# EAGLE design blinkm_mk2j1 (EAGLE 6.5.0)
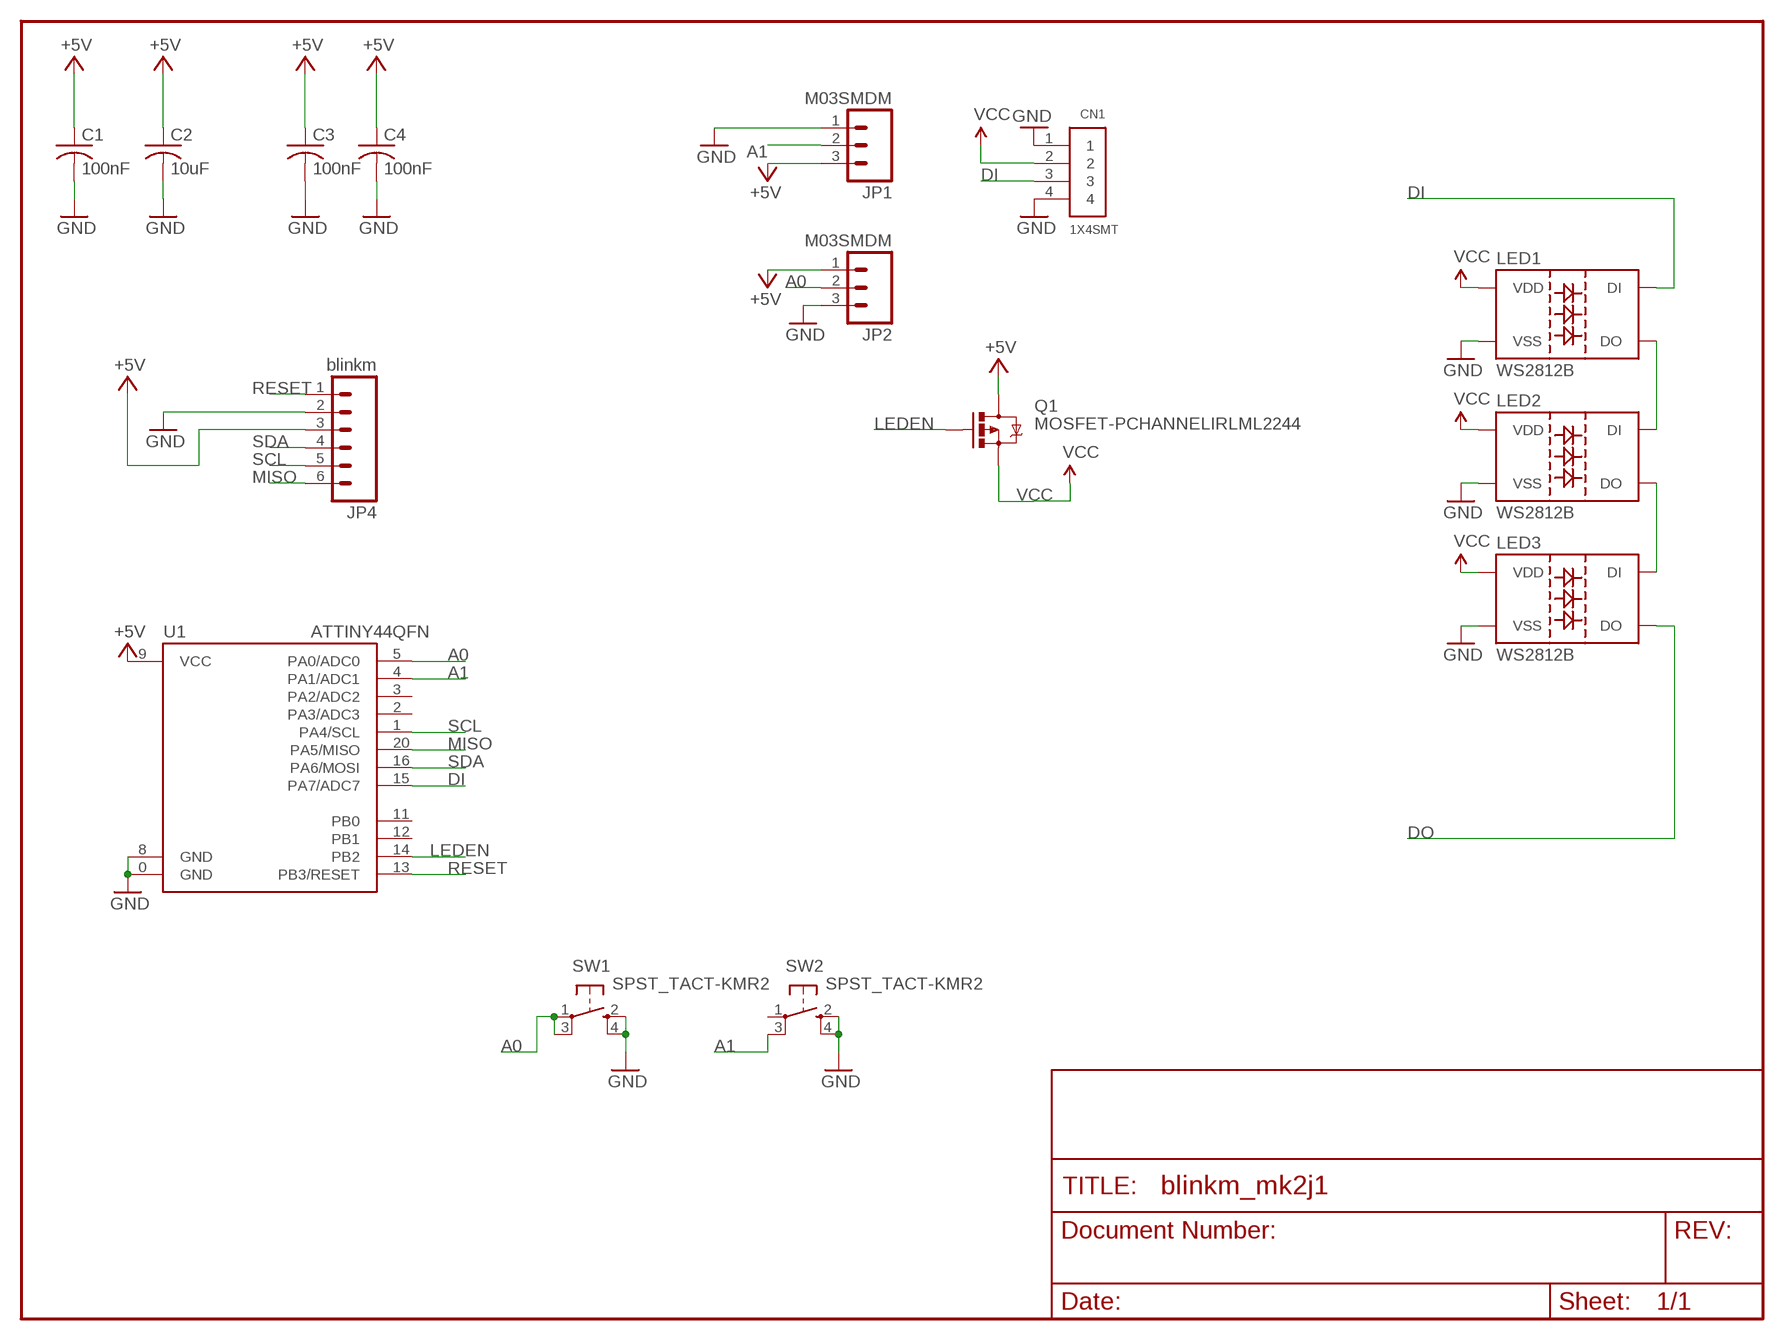
[diagram p0: schematic, sheet 1]

## Parts
C1  100nF  C-USC0603  [C0603]
C2  10uF  C-USC0603  [C0603]
C3  100nF  C-USC0603  [C0603]
C4  100nF  C-USC0603  [C0603]
CN1  1X4SMT  [1X4-SMT]
JP1  M03SMDM  [1X03-SMD-MINIMAL]
JP2  M03SMDM  [1X03-SMD-MINIMAL]
JP4  blinkm  M06LOCK  [1X06_LOCK]
LED1  WS2812B  [WS2812B]
LED2  WS2812B  [WS2812B]
LED3  WS2812B  [WS2812B]
Q1  MOSFET-PCHANNELIRLML2244  [SOT23-3]
SW1  SPST_TACT-KMR2  [KMR2]
SW2  SPST_TACT-KMR2  [KMR2]
U1  ATTINY44QFN  ATTINY24QFN  [QFN20]

## Nets
+5V: C1.1 C2.1 C3.1 C4.1 JP1.3 JP2.1 JP4.3 Q1.3(D) U1.9(VCC)
A0: JP2.2 SW1.1(P) SW1.3(P1) U1.5(PA0/ADC0)
A1: JP1.2 SW2.3(P1) U1.4(PA1/ADC1)
DI: CN1.3 LED1.4(DI) U1.15(PA7/ADC7)
DO: LED3.2(DO)
DOI1: LED1.2(DO) LED2.4(DI)
DOI2: LED2.2(DO) LED3.4(DI)
GND: C1.2 C2.2 C3.2 C4.2 CN1.1 CN1.4 JP1.1 JP2.3 JP4.2 LED1.3(VSS) LED2.3(VSS) LED3.3(VSS) SW1.2(S) SW1.4(S1) SW2.2(S) SW2.4(S1) U1.0(GND) U1.8(GND)
LEDEN: Q1.1(G) U1.14(PB2)
MISO: JP4.6 U1.20(PA5/MISO)
RESET: JP4.1 U1.13(PB3/RESET)
SCL: JP4.5 U1.1(PA4/SCL)
SDA: JP4.4 U1.16(PA6/MOSI)
VCC: CN1.2 LED1.1(VDD) LED2.1(VDD) LED3.1(VDD) Q1.2(S)
Unconnected: SW2.1(P) U1.2(PA3/ADC3) U1.3(PA2/ADC2) U1.11(PB0) U1.12(PB1)

## Library data of the parts
C1-C4 = rcl:C-US: CAPACITOR, American symbol
CN1 = adafruit:1X4: 4-pin connector
JP1 JP2 = todstuff:M03
JP4 = SparkFun-Connectors:M06: Header 6 Standard 6-pin 0.1" header. Use with straight break away headers (SKU : PRT-00116), right angle break away headers (PRT-00553), swiss pins (PRT-00743), machine pins (PRT-00117), and female headers (PRT-00115). Molex polarized connector foot print use with SKU : PRT-08094 with associated crimp pins and housings. NOTES ON THE VARIANTS LOCK and LOCK_LONGPADS... This footprint was designed to help hold the alignment of a through-hole component (i.e. 6-pin header) while soldering it into place. You may notice that each hole has been shifted either up or down by 0.005 of an inch from it's more standard position (which is a perfectly straight line). This slight alteration caused the pins (the squares in the middle) to touch the edges of the holes. Because they are alternating, it causes a "brace" to hold the component in place. 0.005 has proven to be the perfect amount of "off-center" position when using our standard breakaway headers. Although looks a little odd when you look at the bare footprint, once you have a header in there, the alteration is very hard to notice. Also, if you push a header all the way into place, it is covered up entirely on the bottom side. This idea of altering the position of holes to aid alignment will be further integrated into the Sparkfun Library for other footprints. It can help hold any component with 3 or more connection pins.
LED1-LED3 = WS2812:WS2812B
Q1 = SparkFun-DiscreteSemi:MOSFET-PCHANNEL: Generic PMOSFET; PROD_ID: TRANS-11153
SW1 SW2 = adafruit:SPST_TACT: SMT 6mm switch, EVQQ2 series http://www.ladyada.net/library/eagle
U1 = SparkFun-DigitalIC:ATTINY24: Atmel 20-pin 2kB flash uC

## Board
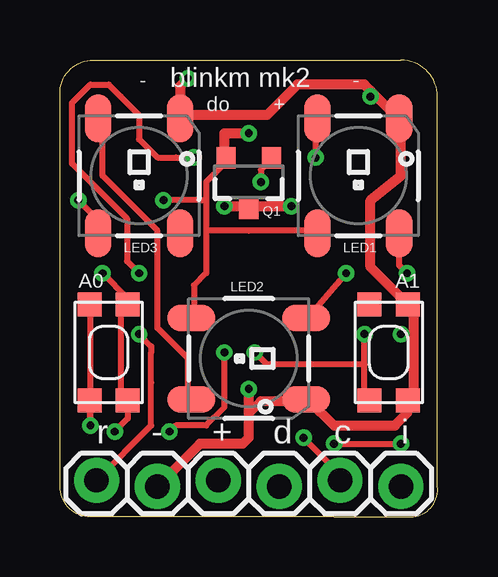
[diagram p1: board, top side]
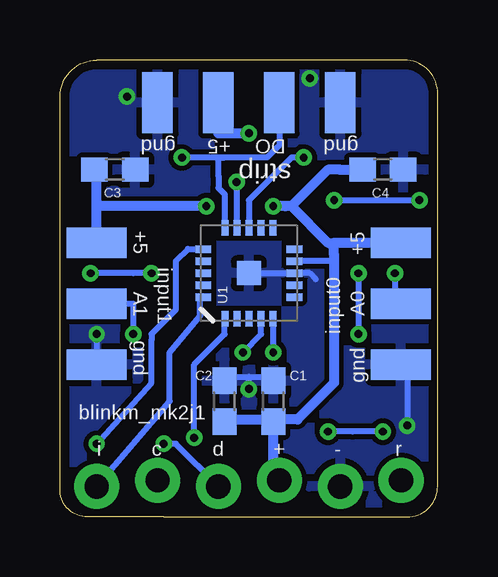
[diagram p2: board, bottom side, seen from below]

Size 15.75 x 19.06 mm. Coordinates in mm from the lower left corner, seen from the top.
Outline: 11.43,0 1.27,0 arc-90 0,1.27 0,17.78 arc-90 1.52,19.05 14.22,19.05 arc-90 15.75,17.53 15.75,1.27 arc-90 14.73,0 11.43,0
Copper layers (1*16): Top 0.0356mm / dielectric 1.5011mm / Bottom 0.0356mm
Design rules "LaenPCBOrder-tod *": minimum track width 10mil, minimum drill 13mil, track to track 8mil, track to pad 8mil, pad to pad 8mil, via to via 8mil, smd to smd 6mil, copper to edge 15mil, drill to drill 8mil, minimum pad ring 7mil, minimum via ring 7mil, stop-mask expansion 4mil, vias tented up to drill 25mil, thermal gap 10mil

### Footprints (pad centres in the part's own frame; a part is rotated, then mirrored left to right if it is on the bottom)
C0603 = smd 1.1 x 1: 1 -0.85,0; 2 0.85,0
1X4-SMT = smd 1.27 x 2.54: 1 -3.81,0; 2 -1.27,0; 3 1.27,0; 4 3.81,0
1X03-SMD-MINIMAL = smd 1.27 x 2.5: 1 -2.54,-0.01; 2 0,-0.01; 3 2.54,-0.01
1X06_LOCK = drill 1.016 pad 1.88: 1 0,0; 2 2.54,-0.254; 3 5.08,0; 4 7.62,-0.254; 5 10.16,0; 6 12.7,-0.254
WS2812B = smd 2 x 1.1: 1 2.4,-1.7; 2 2.4,1.7; 3 -2.4,1.7; 4 -2.4,-1.7
SOT23-3 = smd 0.8 x 0.9: 1 -0.95,-1; 2 0.95,-1; 3 0,1.1
KMR2 = smd 1 x 1: 1 2,0.8; 2 2,-0.8; 3 -2,0.8; 4 -2,-0.8
QFN20 = smd 1 x 1: 0 0,0 | smd 0.65 x 0.3: 1 -1.9,1; 2 -1.9,0.5; 3 -1.9,0; 4 -1.9,-0.5; 5 -1.9,-1; 11 1.9,-1; 12 1.9,-0.5; 13 1.9,0; 14 1.9,0.5; 15 1.9,1 | smd 0.3 x 0.65: 6 -1,-1.9; 7 -0.5,-1.9; 8 0,-1.9; 9 0.5,-1.9; 10 1,-1.9; 16 1,1.9; 17 0.5,1.9; 18 0,1.9; 19 -0.5,1.9; 20 -1,1.9

### Placement (x,y rotation side)
C1  6.86,4.83 90 bottom
C2  8.89,4.83 90 bottom
C3  13.46,14.48 0 bottom
C4  2.29,14.48 0 bottom
CN1  7.87,17.27 0 bottom
JP1  14.22,8.89 90 bottom
JP2  1.52,8.89 270 bottom
JP4  1.52,1.52 0 top
LED1  12.45,14.22 270 top
LED2  7.87,6.6 180 top
LED3  3.3,14.22 270 top
Q1  7.87,13.97 180 top
SW1  2.03,6.86 270 top
SW2  13.72,6.86 90 top
U1  7.87,10.16 90 bottom

### Tracks (layer width: path | path; a pad name or v marks a point on that pad's centre or on a via)
+5V  (via drill 0.33)
  Top 0.254: 7.87,12.95 Q1.3 7.87,12.95
  Top 0.406: v6.86,12.95 7.87,12.95 v9.65,12.95
  Bottom 0.254: C1.1 6.86,4.06 C1.1 | 8.89,4.06 C2.1 | 6.86,3.81 C1.1 | 14.22,14.48 C3.1 | 14.22,11.43 JP1.3 | U1.9 5.84,10.67 4.32,10.67 4.32,10.16 | 1.78,11.43 JP2.1 | 3.3,14.48 C4.1 | 6.77,4.06 C1.1
  Bottom 0.406: 8.89,4.06 6.86,4.06 | 6.86,3.81 6.86,1.78 JP4.3 | 14.22,11.43 14.22,12.95 | 14.22,12.95 14.22,14.48 | 3.3,14.48 4.06,14.48 4.57,14.48 6.1,12.95 | v9.65,12.95 14.22,12.95 | 6.1,12.95 6.35,12.95 v6.86,12.95 | 4.32,11.43 4.32,10.92 4.32,10.16 4.32,6.6 4.32,5.59 5.84,4.06 6.77,4.06 | 1.78,11.43 4.06,11.43 4.32,11.43 | 6.1,12.95 4.57,11.43 4.32,11.43
  pour Top: 22.1,18.03 22.1,-2.29 20.32,0 20.32,20.32
A0  (via drill 0.33)
  Top 0.254: v6.86,6.86 6.86,4.57 6.1,3.81 4.83,3.81 v4.57,3.56 | SW1.1 2.83,4.1 v2.29,3.56 | SW1.1 2.76,4.86 | 2.76,4.86 2.54,5.08 | v1.78,10.16 2.83,9.11 SW1.3 2.54,8.57 2.54,5.08 | 2.54,5.08 2.76,4.86 | 2.76,4.86 SW1.1
  Bottom 0.254: v6.86,6.86 6.86,8.13 U1.5 | v4.57,3.56 3.56,3.56 v2.29,3.56 | v1.78,10.16 1.78,8.89 JP2.2
A1  (via drill 0.33)
  Top 0.254: SW2.3 12.7,5.08 12.7,6.35 | 12.7,6.35 8.64,6.35 v8.13,6.86 | 12.7,6.35 v12.7,7.62
  Bottom 0.254: v8.13,6.86 7.37,7.62 7.37,8.13 U1.4 | JP1.2 13.97,8.89 12.7,8.89 12.7,8.64 12.7,7.87 v12.7,7.62
DI  (via drill 0.33)
  Top 0.254: v10.67,14.99 10.67,16.51 LED1.4
  Bottom 0.254: CN1.3 6.6,16.26 6.6,15.49 7.11,14.99 7.87,14.99 8.13,14.99 8.38,14.99 8.89,14.99 | U1.15 8.89,12.19 8.89,13.46 9.14,13.72 9.14,14.22 9.14,14.99 8.89,14.99 | 8.89,14.99 v10.67,14.99
DOI1  (via drill 0.33)
  Top 0.254: LED2.4 10.41,8.38 v11.94,10.16 | 13.97,11.94 LED1.2 14.15,10.49 v14.48,10.16
  Bottom 0.254: v11.94,10.16 12.7,10.16 v14.48,10.16
DOI2
  Top 0.254: LED3.4 1.78,16.51 1.78,14.22 4.06,11.94 4.06,7.87 5.33,6.6 5.33,5.08 LED2.2
GND  (via drill 0.33)
  Top 0.254: 13.97,16.76 LED1.3 14.22,16.51 | 12.95,17.78 v12.95,17.53 | SW1.2 1.27,5.08 v1.27,3.81 1.27,8.64 SW1.4 | 14.73,5.08 SW2.4 14.48,4.83 | 14.73,8.64 SW2.2 14.73,8.89 | 10.16,4.83 LED2.3 10.41,4.83 | 14.73,7.62 v14.22,7.62 | 5.33,16.76 5.08,16.76 LED3.3 5.33,16.76
  Top 0.406: 5.33,16.76 8.64,16.76 9.91,18.03 12.7,18.03 12.95,17.78 13.97,16.76 | 14.73,8.64 14.73,7.62 14.73,5.08 | 10.41,4.83 11.43,3.81 13.46,3.81 13.97,3.81 14.48,4.32 14.48,4.82 SW2.4 | 14.22,16.51 14.22,14.22 12.95,13.21 12.95,10.41 13.21,10.16 13.72,9.65 14.48,8.89 14.73,8.89 | v7.87,5.33 7.87,3.81 | 7.87,3.81 7.87,3.3 7.62,3.05 6.35,3.05 5.84,3.05 JP4.2 | 10.16,4.83 8.38,4.83 7.87,4.32 7.87,3.81 | v5.33,18.29 5,17.96 LED3.3
  Bottom 0.254: CN1.4 4.06,17.02 | 12.45,14.48 C3.2 | v5.33,18.29 5.08,18.29 | U1.0 6.1,10.16 U1.8 5.84,10.16 5.33,10.16 5.08,9.91 | 7.87,5.84 8.89,5.84 C2.2 | 7.87,5.84 6.86,5.84 | 6.86,5.84 C1.2 6.86,5.84 | v1.27,3.81 1.27,6.6 JP2.3 1.78,6.35 | v14.22,7.62 14.22,6.35 JP1.1 | v7.87,5.33 7.87,5.84 | CN1.1 12.19,16.76 CN1.1
  pour Bottom: -1.52,19.05 -1.52,0.25 18.03,0 18.03,19.05
LEDEN  (via drill 0.33)
  Top 0.254: v8.38,13.97 8.38,14.48 8.64,14.73 Q1.1
  Bottom 0.254: v8.38,13.97 8.38,12.19 U1.14
MISO
  Bottom 0.254: JP4.6 11.18,4.83 11.18,6.86 9.91,8.38 9.91,9.14 U1.20
RESET  (via drill 0.33)
  Top 0.254: v5.59,14.99 4.83,14.99 4.06,14.99 3.3,15.75 3.3,16.76 2.54,17.53 2.03,18.03 1.27,18.03 0.51,17.27 0.51,14.73 2.79,12.45 2.79,10.67 v3.3,10.16 | JP4.1 3.81,3.81 3.81,5.59 3.81,6.86 3.81,7.11 v3.3,7.62
  Bottom 0.254: U1.13 7.87,12.19 7.87,13.21 6.1,14.99 v5.59,14.99 | v3.3,10.16 v3.3,7.62
SCL  (via drill 0.33)
  Top 0.254: v10.16,3.3 11.68,1.78 JP4.5
  Bottom 0.254: v10.16,3.3 10.16,6.35 8.89,7.62 8.89,8.13 U1.1
SDA  (via drill 0.33)
  Top 0.254: v11.43,3.05 v14.22,3.05
  Bottom 0.254: v14.22,3.05 11.94,5.59 11.94,7.37 11.94,7.62 10.92,8.64 10.92,10.67 10.41,11.18 9.91,11.18 U1.16 | v11.43,3.05 10.92,3.05 JP4.4
VCC  (via drill 0.33)
  Top 0.254: LED1.1 10.67,11.94 7.87,11.94 6.1,11.94 | v0.76,13.21 1.52,12.45 1.52,11.94 LED3.1 | v4.32,13.21 5.84,13.21 6.1,13.21 | LED2.1 5.59,8.38 5.59,9.65 6.1,10.16 6.1,10.41 6.1,11.94 | 6.86,14.99 Q1.2 6.86,14.73 6.1,13.97 6.1,13.21 | 6.1,13.21 6.1,11.94
  Top 0.406: 6.86,14.99 6.86,16 v7.87,16
  Bottom 0.254: v4.32,13.21 v0.76,13.21
  Bottom 0.406: CN1.2 9.14,16 v7.87,16

### Text on the board
tPlace: - | blinkm mk2 | - | do | + | A0 | A1 | r | - | + | d | c | i
bPlace: gnd | DO | +5 | gnd | strip | +5 | +5 | input1 | A1 | A0 | input0 | gnd | gnd | blinkm_mk2j1 | r | - | + | d | c | i